# Altium schematic sheet Redriver.SchDoc: Title
size 420 x 297 mm; Author: G.Kasprowicz; CompanyName: WUT ISE; DrawnBy: G.Kasprowicz; Organization: WUT ISE; Address1: PW ISE; Address2: Nowowiejska 15/19 00-665 Warsaw; Address3: gkasprow@gmail.com; Revision: 2; SheetNumber: -; SheetTotal: -; ModifiedBy: -; CheckedDate: -; Title2: Title 2; DivGrp: WUT ISE; Designer: G.Kasprowicz; ModifiedDate: -; ProjectName: Sensor Box
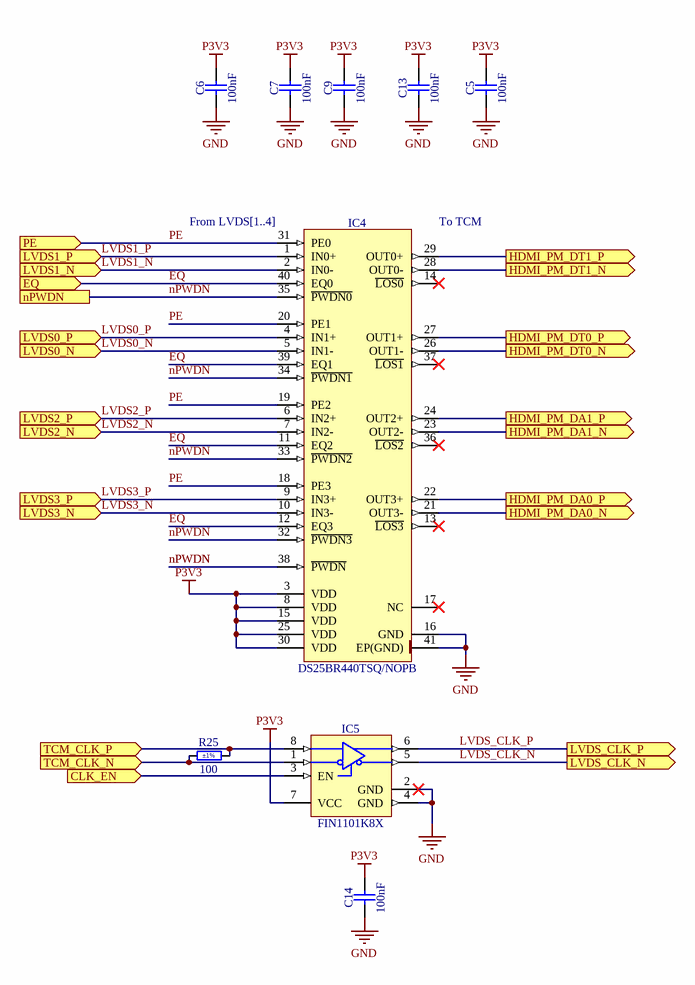
[diagram p0: Redriver.SchDoc]

## Parts
C5  100nF  [CAPC1005X55N]
C6  100nF  [CAPC1005X55N]
C7  100nF  [CAPC1005X55N]
C9  100nF  [CAPC1005X55N]
C13  100nF  [CAPC1005X55N]
C14  100nF  [CAPC1005X55N]
IC4  DS25BR440TSQ/NOPB  [QFN50P600X600X80-41N-S480]
IC5  FIN1101K8X  [SOP50P310X90-8N]
R25  100  Tolerance: ±1%  [RESC1005X40N]

## Ports
CLK_EN (in), EQ (in), HDMI_PM_DA0_N (out), HDMI_PM_DA0_P (out), HDMI_PM_DA1_N (out), HDMI_PM_DA1_P (out), HDMI_PM_DT0_N (out), HDMI_PM_DT0_P (out), HDMI_PM_DT1_N (out), HDMI_PM_DT1_P (out), LVDS0_N (in), LVDS0_P (in), LVDS1_N (in), LVDS1_P (in), LVDS2_N (in), LVDS2_P (in), LVDS3_N (in), LVDS3_P (in), LVDS_CLK_N (out), LVDS_CLK_P (out), nPWDN, PE (in), TCM_CLK_N (in), TCM_CLK_P (in)

## Nets
GND: C5.1 C6.1 C7.1 C9.1 C13.1 C14.1 IC4.16(GND) IC4.41(EP(GND)) IC5.2(GND) IC5.4(GND)
P3V3: C5.2 C6.2 C7.2 C9.2 C13.2 C14.2 IC4.3(VDD) IC4.8(VDD) IC4.15(VDD) IC4.25(VDD) IC4.30(VDD) IC5.7(VCC)
CLK_EN: IC5.3(EN) ; port CLK_EN
EQ: IC4.11(EQ2) IC4.12(EQ3) IC4.39(EQ1) IC4.40(EQ0) ; port EQ
HDMI_PM_DA0_N: IC4.21(OUT3-) ; port HDMI_PM_DA0_N
HDMI_PM_DA0_P: IC4.22(OUT3+) ; port HDMI_PM_DA0_P
HDMI_PM_DA1_N: IC4.23(OUT2-) ; port HDMI_PM_DA1_N
HDMI_PM_DA1_P: IC4.24(OUT2+) ; port HDMI_PM_DA1_P
HDMI_PM_DT0_N: IC4.26(OUT1-) ; port HDMI_PM_DT0_N
HDMI_PM_DT0_P: IC4.27(OUT1+) ; port HDMI_PM_DT0_P
HDMI_PM_DT1_N: IC4.28(OUT0-) ; port HDMI_PM_DT1_N
HDMI_PM_DT1_P: IC4.29(OUT0+) ; port HDMI_PM_DT1_P
LVDS0_N: IC4.5(IN1-) ; port LVDS0_N
LVDS0_P: IC4.4(IN1+) ; port LVDS0_P
LVDS1_N: IC4.2(IN0-) ; port LVDS1_N
LVDS1_P: IC4.1(IN0+) ; port LVDS1_P
LVDS2_N: IC4.7(IN2-) ; port LVDS2_N
LVDS2_P: IC4.6(IN2+) ; port LVDS2_P
LVDS3_N: IC4.10(IN3-) ; port LVDS3_N
LVDS3_P: IC4.9(IN3+) ; port LVDS3_P
LVDS_CLK_N: IC5.5(DOUT-) ; port LVDS_CLK_N
LVDS_CLK_P: IC5.6(DOUT+) ; port LVDS_CLK_P
nPWDN: IC4.32(~{PWDN3}) IC4.33(~{PWDN2}) IC4.34(~{PWDN1}) IC4.35(~{PWDN0}) IC4.38(~{PWDN}) ; port nPWDN
PE: IC4.18(PE3) IC4.19(PE2) IC4.20(PE1) IC4.31(PE0) ; port PE
TCM_CLK_N: IC5.1(RIN-) R25.1 ; port TCM_CLK_N
TCM_CLK_P: IC5.8(RIN+) R25.2 ; port TCM_CLK_P

Not connected (* = marked no-connect by the designer): IC4 13(~{LOS3})* 14(~{LOS0})* 17(NC)* 36(~{LOS2})* 37(~{LOS1})*

## Notes on the sheet
- (near IC4) From LVDS[1..4]
- (near IC4) To TCM
- Project/Equipment
- Document
- Designer
- Drawn by
- Check.by
- Copyright WUT ISE 2024.
  This documentation describes Open Hardware and is licensed under the CERN OHL v.2. You may redistribute and modify this documentation under the terms of the CERN OHL v.2. (http://ohwr.org/CERNOHL). This documentation is distributed WITHOUT ANY EXPRESS OR IMPLIED WARRANTY, INCLUDING OF MERCHANTABILITY, SATISFACTORY QUALITY AND FITNESS FOR A PARTICULAR PURPOSE. Please see the CERN OHL v.2 for applicable conditions.
- Contact
- File
- Last Mod.
- Print Date
- Sheet
- Size
- A3
- of
- Rev

## Library data of the parts
C5-C7 C9 C13 C14 = CC0402_100NF_50V_10%_X7R: Non-polarised capacitor; Part Description: SMD Multilayer Chip Ceramic Capacitor; Manufacturer: GENERIC; Manufacturer1 Part Number: GRM155R71H104KE14D; Voltage: 50V; TC: X7R; Tolerance: ±10%; Part Number: CC0402_100NF_50V_10%_X7R; Component Kind: Standard; Component Type: Standard; Pin Count: 2; Value: 100nF; Status: None; Manufacturer Part Number: CC0402_100NF_50V_10%_X7R; Case: 0402; Mounted: Yes; Socket: No; SMD: Yes; Sense: No; Manufacturer1 Example: MURATA; Manufacturer1 ComponentHeight: 0.55mm; HelpURL: \\cern.ch\dfs\Applications\Altium\Datasheets\CC0402_MURATA_GRM155R71H104KE14D.pdf; Author: CERN DEM MR; CreateDate: 30.06.2017; LatestRevisionDate: 30.06.2017
IC4 = DS25BR440TSQ/NOPB: 3.125-Gbps Quad LVDS Buffer with Transmit Pre-Emphasis and Receive Equalization; Manufacturer: TEXAS INSTRUMENTS; PressFit: No; Bonding: No; Part Number: DS25BR440TSQ/NOPB; Component Kind: Standard; Component Type: Standard; Device: DS25BR440TSQ/NOPB; PackageDescription: QFN, 0.50mm Pitch, Square; 40 Pin, 6.00mm L X 6.00mm W X 0.80mm H Body (w/Thermal Tab 4.80 x 4.80mm), IPC Medium Density; Part Description: 3.125-Gbps Quad LVDS Buffer with Transmit Pre-Emphasis and Receive Equalization; Manufacturer Part Number: DS25BR440TSQ; Pin Count: 41; Case: QFN40; Mounted: Yes; Socket: No; SMD: Yes; Sense: No; ComponentHeight: 0.8mm; Author: CERN DEM HF; HelpURL: \\cern.ch\dfs\Applications\Altium\Datasheets\DS25BR440TSQ-NOPB.pdf; CreateDate: 05.11.2021; LatestRevisionDate: 01.06.2022
IC5 = FIN1101K8X: LVDS Single Port High Speed Repeater; Manufacturer: FAIRCHILD SEMICONDUCTOR; PressFit: No; Bonding: No; Part Number: FIN1101K8X; Component Kind: Standard; Component Type: Standard; Device: FIN1101K8X; PackageDescription: SOP, 0.50mm Pitch; 8 Pin, 2.30mm W X 2.00mm L X 0.90mm H body, IPC Medium Density; Part Description: LVDS Single Port High Speed Repeater; Manufacturer Part Number: FIN1101K8X; Pin Count: 8; Case: TSSOP8; Mounted: Yes; Socket: No; SMD: Yes; Sense: No; ComponentHeight: 0.9mm; Author: CERN DEM JLC; HelpURL: \\cern.ch\dfs\Applications\Altium\Datasheets\FIN1101K8X.pdf; CreateDate: 08.11.2016; LatestRevisionDate: 08.11.2016
R25 = R0402_100R_1%_0.0625W_100PPM: Resistor - 1%; Part Description: General Purpose Thick Film Chip Resistor; Manufacturer: GENERIC; Manufacturer1 Part Number: 232270671001L; TC: ±100ppm/°C; PressFit: No; Part Number: R0402_100R_1%_0.0625W_100PPM; Component Kind: Standard; Component Type: Standard; Pin Count: 2; Value: 100; Status: Not Recommended; Power: 0.0625W; Manufacturer Part Number: R0402_100R_1%_0.0625W_100PPM; Case: 0402; Mounted: Yes; Sense: No; Socket: No; SMD: Yes; Manufacturer1 Example: YAGEO PHYCOMP; Manufacturer1 ComponentHeight: 0.4mm; HelpURL: \\cern.ch\dfs\Applications\Altium\Datasheets\R0402_Phycomp_RC0402.pdf; Author: CERN DEM JLC; CreateDate: 03.12.2007; LatestRevisionDate: 17.10.2012